# Altium project 200130 Precharge Controller R2.PrjPcb (part 2 of 2)
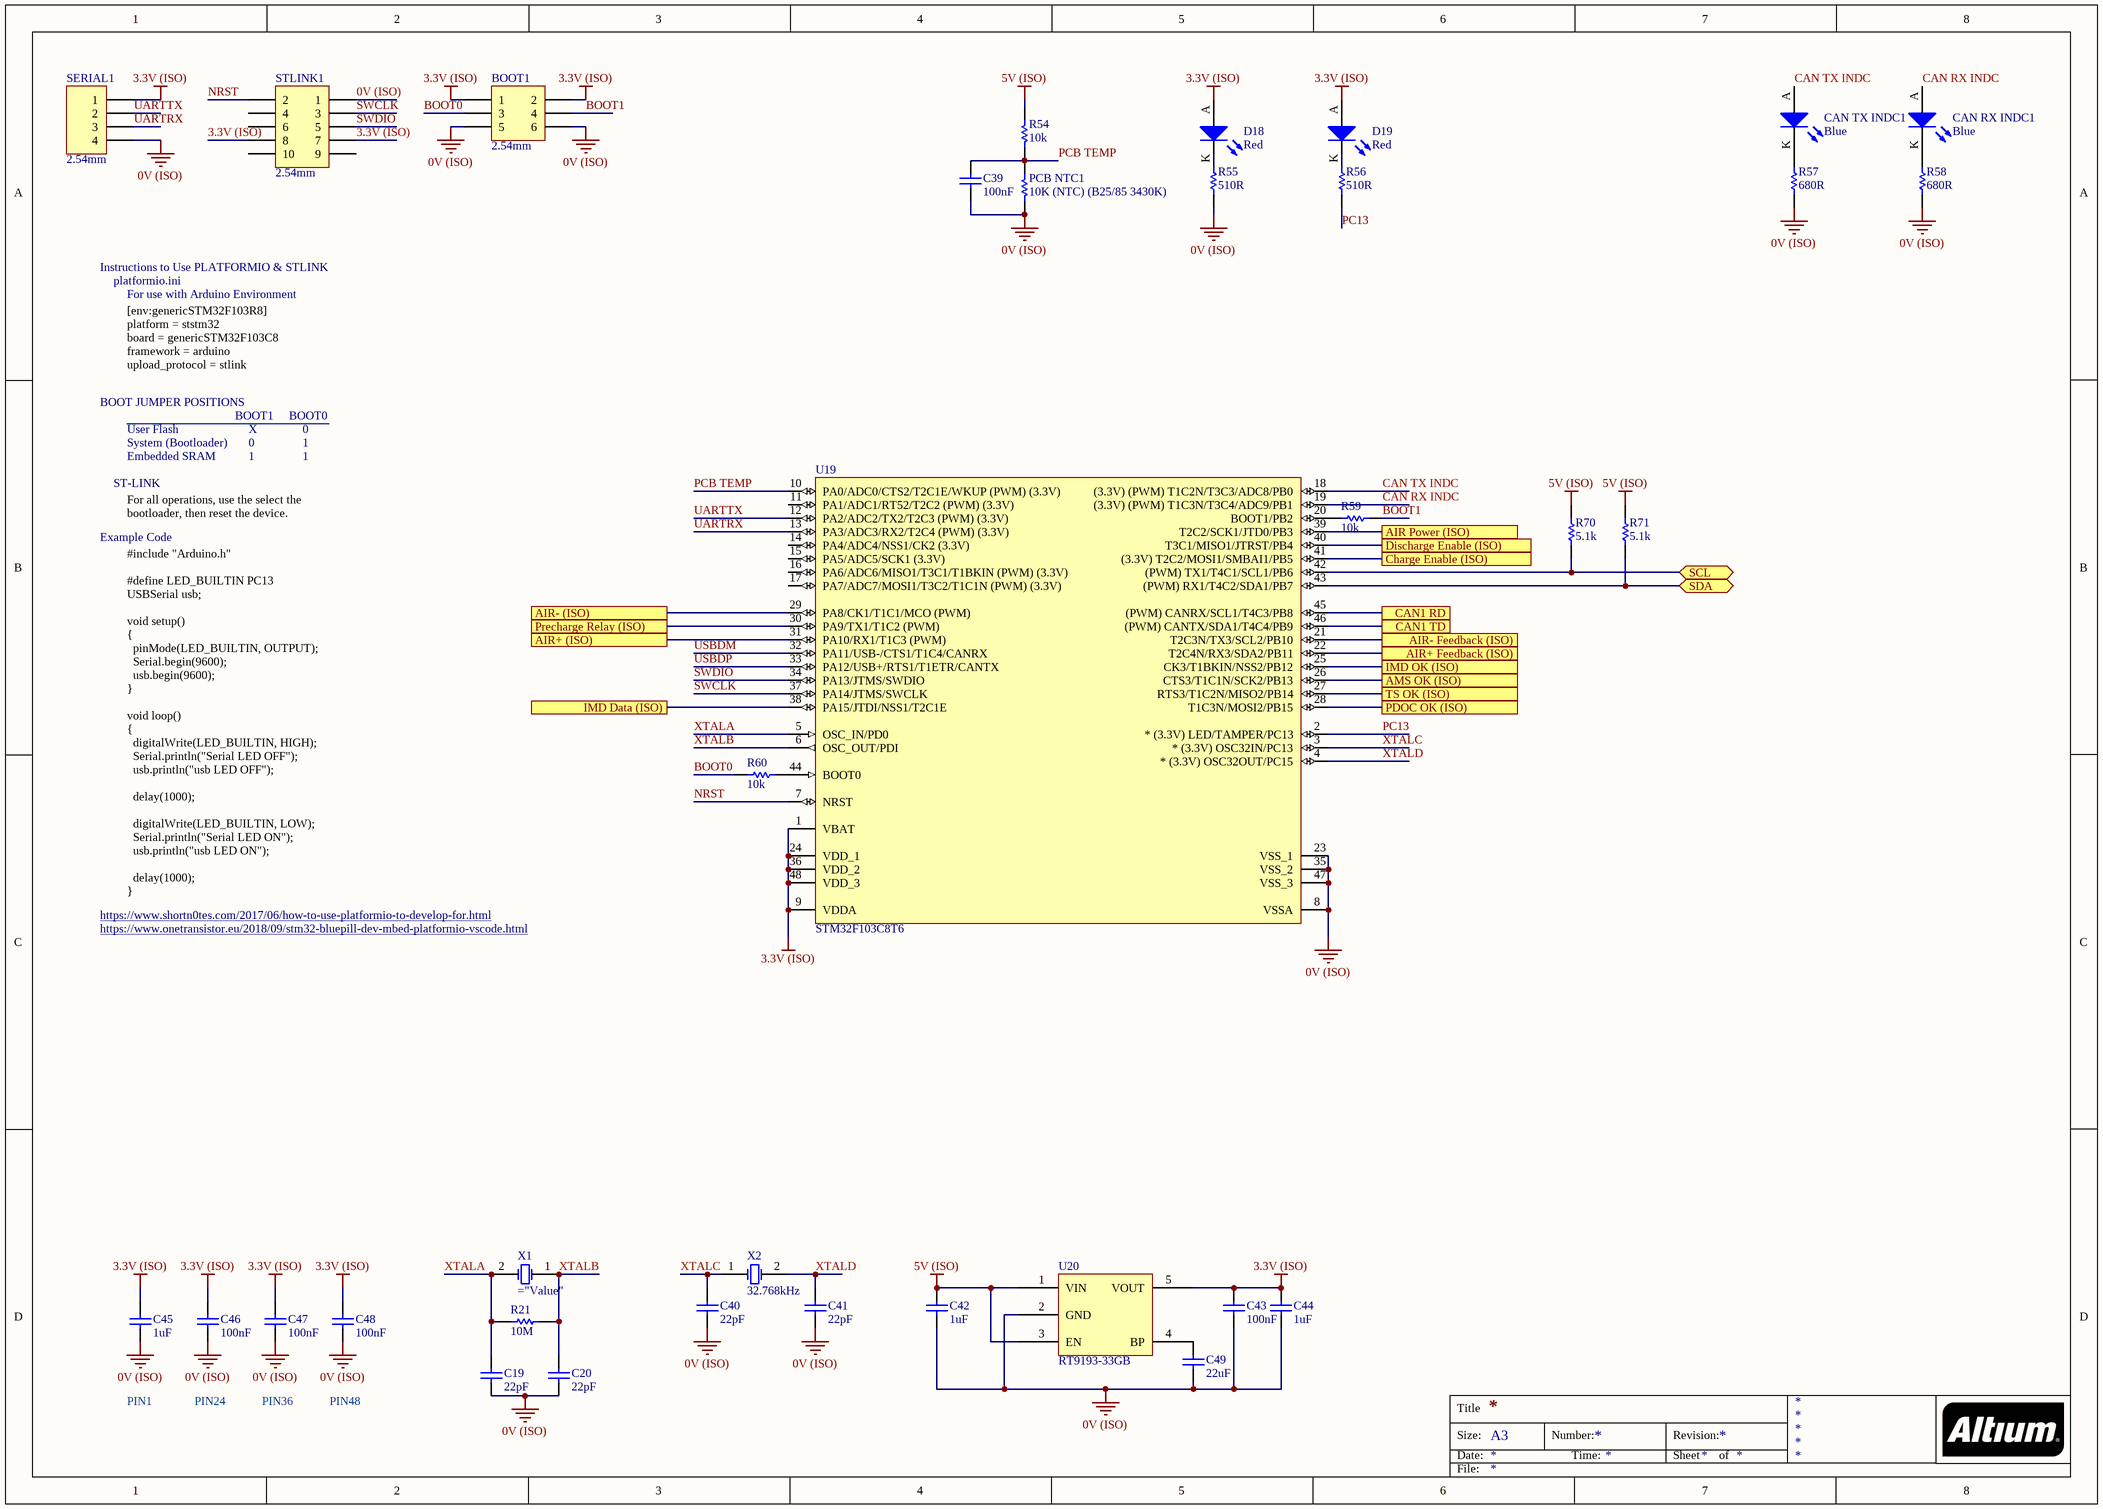
[diagram p9: Microcontroller.SchDoc]

## Nets that join several sheets
0V (ISO): CAN (9 pins), Power Supply (0V_ISO_TP.1 C27.1 R3.1 U5.16), Safety Loops (7 pins), U_HV Sense (9 pins), U_HV Sense (9 pins), Precharge (7 pins), PDOC (10 pins), Digital Isolation (C29.1 R36.1 U16.9 U16.15), Microcontroller (26 pins)
5V: Power Supply (5V_TP.1 C15.2 D16.A U4.3), Safety Loops (U15.1), Precharge (5 pins), Digital Isolation (C28.2 R40.2 R43.2 U16.1)
5V (ISO): CAN (6 pins), Power Supply (5V_ISO_TP.1 C27.2 D17.A U5.14), Safety Loops (14 pins), U_HV Sense (6 pins), U_HV Sense (6 pins), Precharge (8 pins), PDOC (7 pins), Digital Isolation (C29.2 U11.4 U16.10 U16.16), Microcontroller (6 pins)
12V/24V: Top Level (IMD_INTERFACE.2), Power Supply (6 pins)
AIR Power: Top Level (PRIMARY_INTERFACE.15 PRIMARY_INTERFACE.18 PRIMARY_INTERFACE.22), Precharge (5 pins)
GLV-: Top Level (5 pins), Power Supply (5 pins), Safety Loops (R30.1), Precharge (8 pins), Digital Isolation (C28.1 U11.2 U16.2 U16.8)
HV Battery-: Top Level (6 pins), U_HV Sense (13 pins), U_HV Sense (12 pins), PDOC (17 pins)
TS In: Top Level (PRIMARY_INTERFACE.9), Power Supply (C14.1 C15.1 R2.1 U4.2)
VDDISO: U_HV Sense (11 pins), U_HV Sense (12 pins), PDOC (17 pins)
AIR+: Top Level (PRIMARY_INTERFACE.20), Precharge (D6.A D7.K Q7.D)
AIR+ (ISO): Precharge (R24.2 U8.3), Microcontroller (U19.31)
AIR+ Feedback (ISO): Precharge (AIR+_FB_ISO1.1 R7.1 U16.11), Microcontroller (U19.22)
AIR+ Feedback Out: Top Level (PRIMARY_INTERFACE.17), Precharge (R20.1 U16.6)
AIR-: Top Level (PRIMARY_INTERFACE.24), Precharge (D2.A D3.K Q5.D)
AIR- (ISO): Precharge (R8.2 U8.2), Microcontroller (U19.29)
AIR- Feedback (ISO): Precharge (AIR-_FB_ISO_TP1.1 R4.1 U16.12), Microcontroller (U19.21)
AIR- Feedback Out: Top Level (PRIMARY_INTERFACE.5 PRIMARY_INTERFACE.21), Precharge (R5.1 U16.5)
AMS OK (ISO): Safety Loops (AMS_OK_TP1.1 Q3.G R38.2), Microcontroller (U19.26)
CAN RX: CAN (CAN_RX_TP.1 U1.4), Microcontroller (U19.45)
CAN TX: CAN (CAN_TX_TP.1 U1.5), Microcontroller (U19.46)
CANH: Top Level (PRIMARY_INTERFACE.3), CAN (C11.2 CAN_TERM_R1.2 U2.2)
CANL: Top Level (PRIMARY_INTERFACE.4), CAN (C10.2 CAN_TERM_R2.1 U2.1)
CANS: Top Level (PRIMARY_INTERFACE.6), CAN (15 pins)
Charge Enable: Top Level (PRIMARY_INTERFACE.12), Digital Isolation (R43.1 U16.4)
Charge Enable (ISO): Digital Isolation (U16.13), Microcontroller (U19.41)
Discharge Enable: Top Level (PRIMARY_INTERFACE.11), Digital Isolation (R40.1 U16.3)
Discharge Enable (ISO): Digital Isolation (U16.14), Microcontroller (U19.40)
GLV+: Top Level (PRIMARY_INTERFACE.1), Power Supply (F1.1 GLV+_TP1.1)
Green In: Top Level (PRIMARY_INTERFACE.8), Safety Loops (IMD_Bypass1.3 K1.11)
Green Out: Top Level (PRIMARY_INTERFACE.7), Safety Loops (K4.13 PDOC_Bypass1.2)
HV Battery+: Top Level (HV_BATTERY+.1 HV_BATTERY+.2), U_HV Sense (R44_U_HV_Sense#1.2), Precharge (R17.1)
HV MC+: Top Level (HV_IMD+.1 HV_IMD+.2 HV_MC+.1 HV_MC+.2), U_HV Sense (R44_U_HV_Sense#2.2), Precharge (R11.2)
IMD Data: Top Level (IMD_INTERFACE.8), Digital Isolation (R26.1)
IMD Data (ISO): Digital Isolation (R31.1), Microcontroller (U19.38)
IMD OK: Top Level (IMD_INTERFACE.6), Safety Loops (U14.1)
IMD OK (ISO): Safety Loops (IMD_OK_TP1.1 Q1.G R28.1 R29.2), Microcontroller (U19.25)
NetAIR_POW_TP1_1: Precharge (AIR_POW_TP1.1 R10.1), Microcontroller (U19.39)
PDOC OK (ISO): Safety Loops (PDOC_OK_TP1.1 Q4.G), PDOC (R73.1 U24.4), Microcontroller (U19.28)
Precharge Relay (ISO): Precharge (PCH_G_TP1.1 Q6.G R19.2), Microcontroller (U19.30)
SCL: U_HV Sense (U18_U_HV_Sense#1.2), U_HV Sense (U18_U_HV_Sense#2.2), PDOC (U23.2), Microcontroller (R70.1 U19.42)
SDA: U_HV Sense (U18_U_HV_Sense#1.3), U_HV Sense (U18_U_HV_Sense#2.3), PDOC (U23.3), Microcontroller (R71.1 U19.43)
TS OK (ISO): Safety Loops (Q2.G R33.1 R34.2 TS_OK_TP1.1), Microcontroller (U19.27)
TS Out: Top Level (PRIMARY_INTERFACE.10), Safety Loops (R35.2)